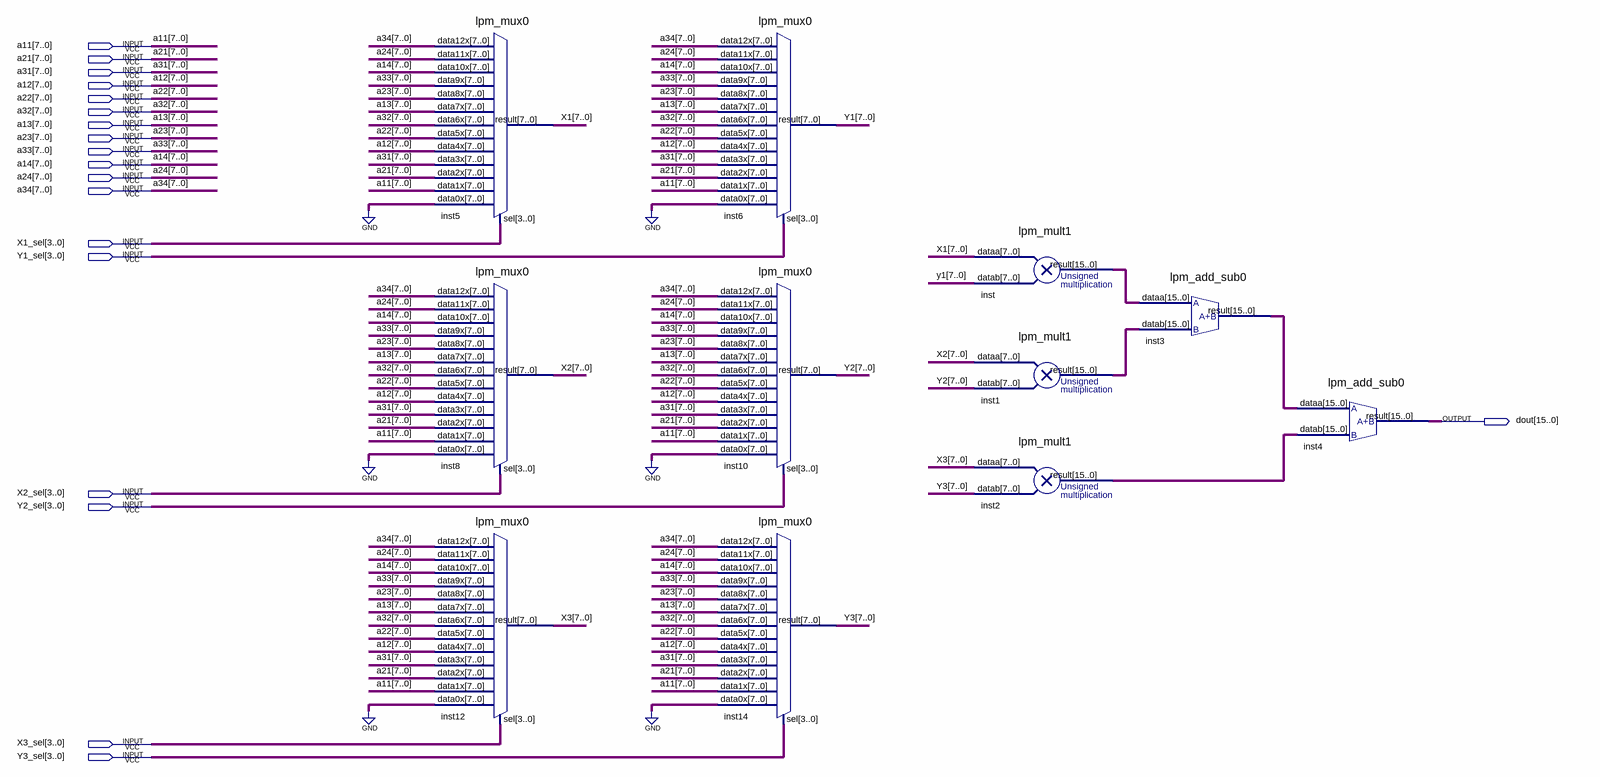
[diagram p0: schematic sheet]
// Quartus schematic MAC.bdf as structural Verilog: 11 symbols, 19 pins
module MAC (
  input  [7:0] a11,
  input  [7:0] a21,
  input  [7:0] a31,
  input  [7:0] a12,
  input  [7:0] a22,
  input  [7:0] a32,
  input  [7:0] a13,
  input  [7:0] a23,
  input  [7:0] a33,
  input  [7:0] a14,
  input  [7:0] a24,
  input  [7:0] a34,
  input  [3:0] X1_sel,
  input  [3:0] Y1_sel,
  input  [3:0] X2_sel,
  input  [3:0] Y2_sel,
  input  [3:0] X3_sel,
  input  [3:0] Y3_sel,
  output [15:0] dout
);

  wire [7:0] X1, X2, X3, y1, Y2, Y3;
  wire [15:0] inst1_result, inst2_result, inst3_result, inst_result;

  lpm_mux0 inst5 (
    .data12x(a34), .data11x(a24), .data10x(a14), .data9x(a33), .data8x(a23), .data7x(a13), .data6x(a32),
    .data5x(a22), .data4x(a12), .data3x(a31), .data2x(a21), .data1x(a11), .data0x({8{1'b0}}), .sel(X1_sel),
    .result(X1));
  lpm_mux0 inst8 (
    .data12x(a34), .data11x(a24), .data10x(a14), .data9x(a33), .data8x(a23), .data7x(a13), .data6x(a32),
    .data5x(a22), .data4x(a12), .data3x(a31), .data2x(a21), .data1x(a11), .data0x({8{1'b0}}), .sel(X2_sel),
    .result(X2));
  lpm_mux0 inst12 (
    .data12x(a34), .data11x(a24), .data10x(a14), .data9x(a33), .data8x(a23), .data7x(a13), .data6x(a32),
    .data5x(a22), .data4x(a12), .data3x(a31), .data2x(a21), .data1x(a11), .data0x({8{1'b0}}), .sel(X3_sel),
    .result(X3));
  lpm_mux0 inst6 (
    .data12x(a34), .data11x(a24), .data10x(a14), .data9x(a33), .data8x(a23), .data7x(a13), .data6x(a32),
    .data5x(a22), .data4x(a12), .data3x(a31), .data2x(a21), .data1x(a11), .data0x({8{1'b0}}), .sel(Y1_sel),
    .result(y1));
  lpm_mux0 inst10 (
    .data12x(a34), .data11x(a24), .data10x(a14), .data9x(a33), .data8x(a23), .data7x(a13), .data6x(a32),
    .data5x(a22), .data4x(a12), .data3x(a31), .data2x(a21), .data1x(a11), .data0x({8{1'b0}}), .sel(Y2_sel),
    .result(Y2));
  lpm_mux0 inst14 (
    .data12x(a34), .data11x(a24), .data10x(a14), .data9x(a33), .data8x(a23), .data7x(a13), .data6x(a32),
    .data5x(a22), .data4x(a12), .data3x(a31), .data2x(a21), .data1x(a11), .data0x({8{1'b0}}), .sel(Y3_sel),
    .result(Y3));
  lpm_mult1 inst (.dataa(X1), .datab(y1), .result(inst_result));
  lpm_mult1 inst1 (.dataa(X2), .datab(Y2), .result(inst1_result));
  lpm_mult1 inst2 (.dataa(X3), .datab(Y3), .result(inst2_result));
  lpm_add_sub0 inst3 (.dataa(inst_result), .datab(inst1_result), .result(inst3_result));
  lpm_add_sub0 inst4 (.dataa(inst3_result), .datab(inst2_result), .result(dout));
endmodule
